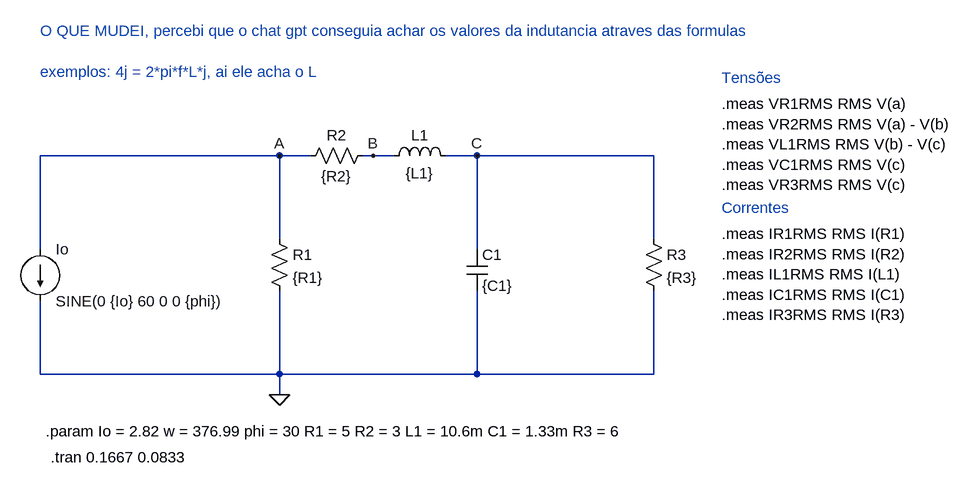
[diagram p0: schematic Lab EAD 2 final.asc]
Lab EAD 2 final.asc, the LTspice schematic file:
Version 4
SHEET 1 1828 680
WIRE 400 -16 32 -16
WIRE 448 -16 400 -16
WIRE 544 -16 528 -16
WIRE 576 -16 544 -16
WIRE 704 -16 656 -16
WIRE 976 -16 704 -16
WIRE 400 112 400 -16
WIRE 976 112 976 -16
WIRE 32 128 32 -16
WIRE 704 128 704 -16
WIRE 32 320 32 208
WIRE 400 320 400 192
WIRE 400 320 32 320
WIRE 704 320 704 192
WIRE 704 320 400 320
WIRE 976 320 976 192
WIRE 976 320 704 320
WIRE 400 352 400 320
FLAG 400 352 0
FLAG 400 -16 A
FLAG 704 -16 C
FLAG 544 -16 B
SYMBOL current 32 128 R0
WINDOW 123 0 0 Left 0
WINDOW 39 0 0 Left 0
SYMATTR InstName Io
SYMATTR Value SINE(0 {Io} 60 0 0 {phi})
SYMBOL res 384 96 R0
SYMATTR InstName R1
SYMATTR Value {R1}
SYMBOL res 960 96 R0
SYMATTR InstName R3
SYMATTR Value {R3}
SYMBOL res 544 -32 R90
WINDOW 0 0 56 VBottom 2
WINDOW 3 32 56 VTop 2
SYMATTR InstName R2
SYMATTR Value {R2}
SYMBOL ind 560 0 R270
WINDOW 0 32 56 VTop 2
WINDOW 3 5 56 VBottom 2
SYMATTR InstName L1
SYMATTR Value {L1}
SYMBOL cap 688 128 R0
SYMATTR InstName C1
SYMATTR Value {C1}
TEXT 32 -208 Left 2 ;O QUE MUDEI, percebi que o chat gpt conseguia achar os valores da indutancia atraves das formulas\n \nexemplos: 4j = 2*pi*f*L*j, ai ele acha o L
TEXT 40 408 Left 2 !.param Io = 2.82 w = 376.99 phi = 30 R1 = 5 R2 = 3 L1 = 10.6m C1 = 1.33m R3 = 6
TEXT 48 448 Left 2 !.tran 0.1667 0.0833
TEXT 1080 -136 Left 2 ;Tensões
TEXT 1080 -96 Left 2 !.meas VR1RMS RMS V(a)\n.meas VR2RMS RMS V(a) - V(b)\n.meas VL1RMS RMS V(b) - V(c)\n.meas VC1RMS RMS V(c)\n.meas VR3RMS RMS V(c)
TEXT 1080 64 Left 2 ;Correntes
TEXT 1080 104 Left 2 !.meas IR1RMS RMS I(R1)\n.meas IR2RMS RMS I(R2)\n.meas IL1RMS RMS I(L1)\n.meas IC1RMS RMS I(C1)\n.meas IR3RMS RMS I(R3)

The netlist it stands for:
* Lab EAD 2 final.asc
Io A 0 SINE(0 {Io} 60 0 0 {phi})
R1 A 0 {R1}
R3 C 0 {R3}
R2 B A {R2}
L1 B C {L1}
C1 C 0 {C1}
* O QUE MUDEI, percebi que o chat gpt conseguia achar os valores da indutancia atraves das formulas
* exemplos: 4j = 2*pi*f*L*j, ai ele acha o L
.param Io = 2.82 w = 376.99 phi = 30 R1 = 5 R2 = 3 L1 = 10.6m C1 = 1.33m R3 = 6
.tran 0.1667 0.0833
* Tensões
.meas VR1RMS RMS V(a)
.meas VR2RMS RMS V(a) - V(b)
.meas VL1RMS RMS V(b) - V(c)
.meas VC1RMS RMS V(c)
.meas VR3RMS RMS V(c)
* Correntes
.meas IR1RMS RMS I(R1)
.meas IR2RMS RMS I(R2)
.meas IL1RMS RMS I(L1)
.meas IC1RMS RMS I(C1)
.meas IR3RMS RMS I(R3)
.backanno
.end